# Altium schematic sheet PAYL0010 GMSK Modem wo Proto.SchDoc: GMSK Prototyping Board w/o prototyping
size A3; CompanyName: BLUESAT Project; Engineer: Daniel Jedrychowski; Organization: BLUESAT Project; Address1: Room 419; Address2: School of EE&T; Address3: UNSW, NSW 2052; Address4: Australia; DocumentNumber: PAYL0010; SheetNumber: 2; SheetTotal: 2; Description: Connections and external components of a GMSK modem; Version: 1.0
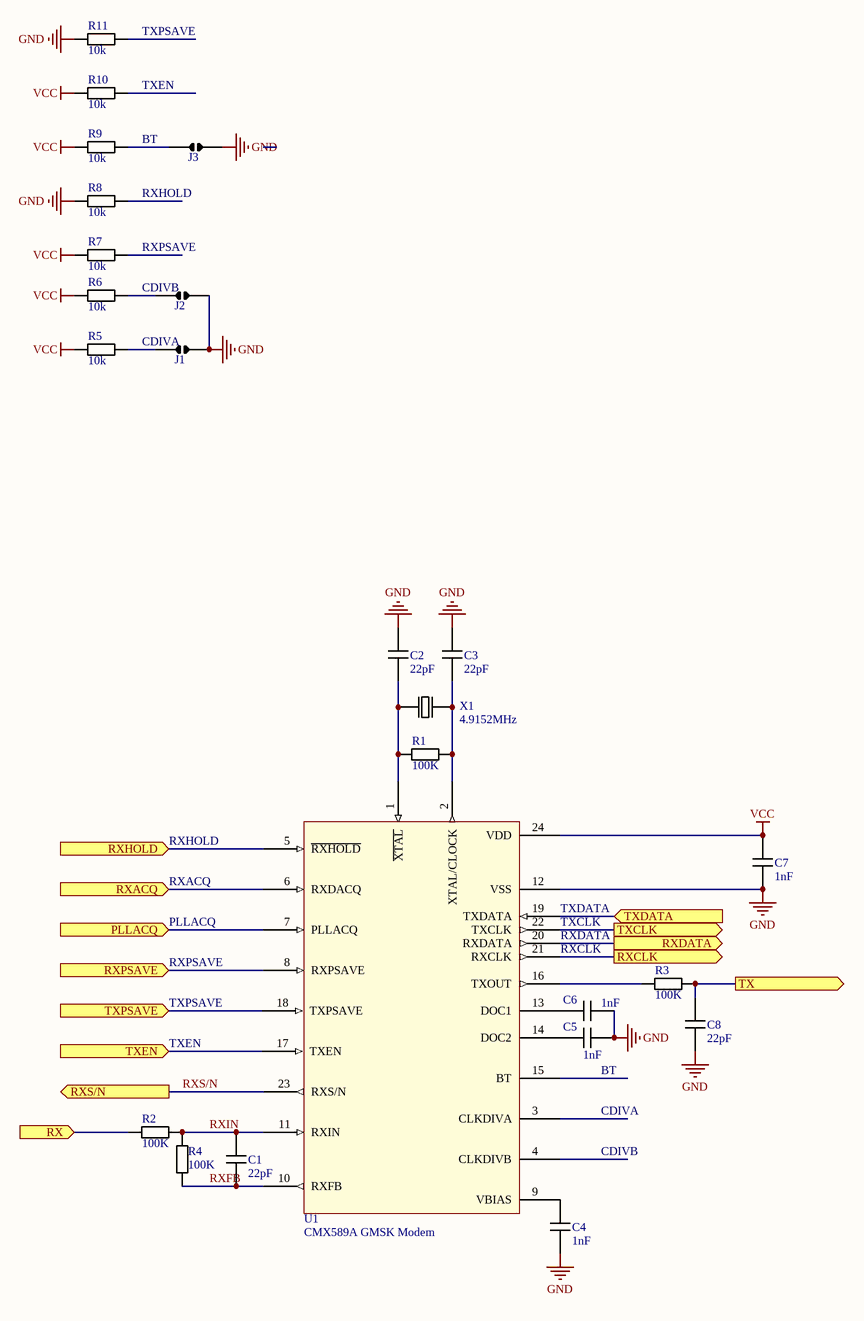
[diagram p0: PAYL0010 GMSK Modem wo Proto.SchDoc]

## Parts
C1  value 22pF  [0805 Cap]  (hidden comment: 0805 Cap)
C2  value 22pF  [0805 Cap]  (hidden comment: 0805 Cap)
C3  value 22pF  [0805 Cap]  (hidden comment: 0805 Cap)
C4  value 1nF  [0805 Cap]  (hidden comment: 0805 Cap)
C5  value 1nF  [0805 Cap]  (hidden comment: 0805 Cap)
C6  value 1nF  [0805 Cap]  (hidden comment: 0805 Cap)
C7  value 1nF  [0805 Cap]  (hidden comment: 0805 Cap)
C8  value 22pF  [0805 Cap]  (hidden comment: 0805 Cap)
J1  Jumper  [Solder Jumper C]  (value not drawn)
J2  Jumper  [Solder Jumper C]  (value not drawn)
J3  Jumper  [Solder Jumper C]  (value not drawn)
R1  value 100K  [0805 Resistor]  (hidden comment: 0805 Resistor)
R2  value 100K  [0805 Resistor]  (hidden comment: 0805 Resistor)
R3  value 100K  [0805 Resistor]  (hidden comment: 0805 Resistor)
R4  value 100K  [0805 Resistor]  (hidden comment: 0805 Resistor)
R5  value 10k  [0805 Resistor]  (hidden comment: 0805 Resistor)
R6  value 10k  [0805 Resistor]  (hidden comment: 0805 Resistor)
R7  value 10k  [0805 Resistor]  (hidden comment: 0805 Resistor)
R8  value 10k  [0805 Resistor]  (hidden comment: 0805 Resistor)
R9  value 10k  [0805 Resistor]  (hidden comment: 0805 Resistor)
R10  value 10k  [0805 Resistor]  (hidden comment: 0805 Resistor)
R11  value 10k  [0805 Resistor]  (hidden comment: 0805 Resistor)
U1  CMX589A GMSK Modem  [SOIC24 - GMSK MODEM]
X1  value 4.9152MHz  [HC49]  (hidden comment: HC49 Crystal)

## Ports
PLLACQ (in), RX (in), RXACQ (in), RXCLK (out), RXDATA (out), RXHOLD (in), RXPSAVE (in), RXS/N (out), TX (out), TXCLK (out), TXDATA (in), TXEN (in), TXPSAVE (in)

## Nets
GND: C2.2 C3.2 C4.2 C5.2 C6.1 C7.2 C8.2 J1.1 J2.2 J3.2 R8.2 R11.2 U1.12(VSS)
VCC: C7.1 R5.2 R6.2 R7.2 R9.2 R10.2 U1.24(VDD)
BT: J3.1 R9.1 U1.15(BT)
CDIVA: J1.2 R5.1 U1.3(CLKDIVA)
CDIVB: J2.1 R6.1 U1.4(CLKDIVB)
PLLACQ: U1.7(PLLACQ) ; port PLLACQ
RX: R2.1 ; port RX
RXACQ: U1.6(RXDACQ) ; port RXACQ
RXCLK: U1.21(RXCLK) ; port RXCLK
RXDATA: U1.20(RXDATA) ; port RXDATA
RXFB: C1.1 R4.2 U1.10(RXFB)
RXHOLD: R8.1 U1.5(~{RXHOLD}) ; port RXHOLD
RXIN: C1.2 R2.2 R4.1 U1.11(RXIN)
RXPSAVE: R7.1 U1.8(RXPSAVE) ; port RXPSAVE
RXS/N: U1.23(RXS/N) ; port RXS/N
TX: C8.1 R3.2 ; port TX
TXCLK: U1.22(TXCLK) ; port TXCLK
TXDATA: U1.19(TXDATA) ; port TXDATA
TXEN: R10.1 U1.17(TXEN) ; port TXEN
TXPSAVE: R11.1 U1.18(TXPSAVE) ; port TXPSAVE
NetC2_1: C2.1 R1.1 U1.1(~{XTAL}) X1.1
NetC3_1: C3.1 R1.2 U1.2(XTAL/CLOCK) X1.2
NetC4_1: C4.1 U1.9(VBIAS)
NetC5_1: C5.1 U1.14(DOC2)
NetC6_2: C6.2 U1.13(DOC1)
NetR3_1: R3.1 U1.16(TXOUT)

## Notes on the sheet
- Title
- Description:
- Size:
- Author:
- Date:
- A3
- Time:
- Version
- Sheet:
- Drawing No.:
- of
- File:

## Library data of the parts
C1-C3 C8 = 0805 MLCC - NP0, 5%
C4-C7 = 0805 MLCC - X7R, 10%
J1-J3 = Solder Bridge
R1-R11 = 0805 Thin Film Resistor 0.1%
U1 = CMX589A